# Altium schematic sheet Connectors.SchDoc
size Letter; Organization: MIT; SheetNumber: 2; SheetTotal: 5; Section: Connectors
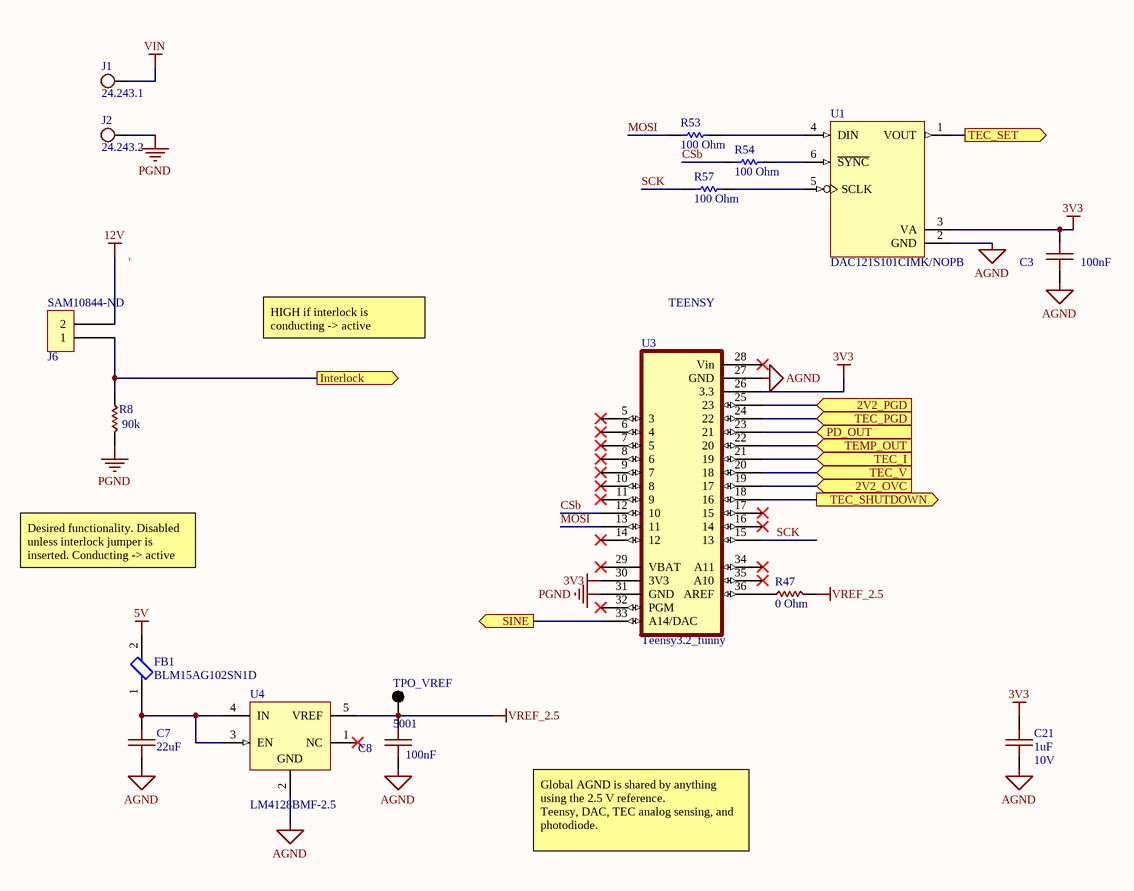
[diagram p0: Connectors.SchDoc]

## Parts
C3  100nF  [0603 B]
C7  22uF  [1210]
C8  100nF  [0603 B]
C21  1uF  Voltage: 10V  [0603 B]
FB1  BLM15AG102SN1D  [FP-BLM15-MFG]
J1  24.243.1  [BANANA RD]  (no BOM)
J2  24.243.2  [BANANA BK]  (no BOM)
J6  Supplier Part Number 1: SAM10844-ND  [SIL02]  (hidden comment: SIL02)
R8  90k  [0603]
R47  0 Ohm  [0603]
R53  100 Ohm  [RESC1608X55X30LL15T15]
R54  100 Ohm  [RESC1608X55X30LL15T15]
R57  100 Ohm  [RESC1608X55X30LL15T15]
TPO_VREF  5001  [KSTN-5001]
U1  DAC121S101CIMK/NOPB  [MK06A_N]
U3  Teensy3.2_funny  [Teensy32_funny]
U4  LM4128BMF-2.5  [DBV0005A_N]

## Ports
2V2_OVC (in), 2V2_PGD (in), Interlock (out), PD_OUT (in), SINE (out), TEC_I (in), TEC_PGD (in), TEC_SET (out), TEC_SHUTDOWN (out), TEC_V (in), TEMP_OUT (in)

## Nets
3V3: C3.1 C21.2 U1.3(VA) U3.26(3.3) U3.30(3V3)
5V: FB1.2
12V: J6.2
AGND: C3.2 C7.2 C8.2 C21.1 U1.2(GND) U3.27(GND) U4.2(GND)
PGND: J2.1(TP) R8.1 U3.31(GND)
VIN: J1.1(TP)
VREF_2.5: C8.1 R47.1 TPO_VREF.1 U4.5(VREF)
2V2_OVC: U3.19(17) ; port 2V2_OVC
2V2_PGD: U3.25(23) ; port 2V2_PGD
CSb: R54.1 U3.12(10)
Interlock: J6.1 R8.2 ; port Interlock
MOSI: R53.1 U3.13(11)
PD_OUT: U3.23(21) ; port PD_OUT
SCK: R57.1 U3.15(13)
SINE: U3.33(A14/DAC) ; port SINE
TEC_I: U3.21(19) ; port TEC_I
TEC_PGD: U3.24(22) ; port TEC_PGD
TEC_SET: U1.1(VOUT) ; port TEC_SET
TEC_SHUTDOWN: U3.18(16) ; port TEC_SHUTDOWN
TEC_V: U3.20(18) ; port TEC_V
TEMP_OUT: U3.22(20) ; port TEMP_OUT
NetC7_1: C7.1 FB1.1 U4.3(EN) U4.4(IN)
NetR47_2: R47.2 U3.36(AREF)
NetR53_2: R53.2 U1.4(DIN)
NetR54_2: R54.2 U1.6(~{SYNC})
NetR57_2: R57.2 U1.5(SCLK)

Not connected (* = marked no-connect by the designer): U3 5(3)* 6(4)* 7(5)* 8(6)* 9(7)* 10(8)* 11(9)* 14(12)* 16(14)* 17(15)* 28(Vin)* 29(VBAT)* 32(PGM)* 34(A11)* 35(A10)*; U4 1(NC)*

## Notes on the sheet
- '
- HIGH if interlock is conducting -> active
- TEENSY
- Desired functionality. Disabled unless interlock jumper is inserted. Conducting -> active
- Global AGND is shared by anything using the 2.5 V reference.
  Teensy, DAC, TEC analog sensing, and photodiode.
- Title
- Size
- Date
- Letter
- Section
- Time
- Sheet
- of
- Revision
- Drawn
- 33-207 / 77 Mass. Ave.
- Cambridge, MA 02139
- File

## Library data of the parts
C3 C8 = CAP 0603: 603 Capacitor; Value: 100nF
C7 = CAP 1210: 1210 Capacitor; Value: 22uF
C21 = CAP 0603: 603 Capacitor; Ref: C1608X7R1E105M080AB; Rating: X7R; Value: 1uF
FB1 = CMP-0686-00181-4: FERRITE BEAD 1 KOHM 0402 1LN; Manufacturer: Murata; 3DS Part Number: 310-00007; Impedance At Frequency: 1kΩ @ 100MHz; Tolerance: 25%; Series Resistance: 650mΩ; Test Frequency: 100MHz; Rms Current: 300mA; Manufacturer Part Number: BLM15AG102SN1D; Octopart: https://octopart.com/blm15ag102sn1d-murata-368316; RoHS: TRUE; Ipc Land Pattern Name: CAPC10050X50; Temperature Range High: +125°C; ComponentLink2Description: Datasheet; Device Class L1: Passive Components; Package: BLM15; Temperature Range Low: -55°C; Core Material: Ferrite; ComponentLink2URL: https://www.murata.com/en-us/products/productdata/8796740059166/ENFA0018.pdf?1514431813000; Mouser Description: Ferrite Beads 1K OHM HIGH SPEED SI; Digikey Description: FERRITE BEAD 1 KOHM 0402 1LN; Temperature: -55°C to +125°C; Category: FBead; Device Class L3: Ferrite Beads and Chips; Device Class L2: EMI / RFI Components; Automotive: No; Height: 0.55mm; Lead Free: Yes
J1 = BANANA RED: Banana jack, PCB mount right angle; Ref: 24.243.1
J2 = BANANA BLACK: Banana jack, PCB mount right angle; Ref: 24.243.2
J6 = SIL02: Conn Unshrouded Header HDR 2 POS 2.54mm Solder ST Top Entry Thru-Hole Bag; Manufacturer: Samtec; Manufacturer Part Number: TSW-102-07-F-S; Ref: 4x1 2.54MM HEADER; Number of Contacts: 2; Gender: Male; Max Current Rating: 7.6A; Max Voltage Rating (AC): 550V; Supplier 1: Digi-Key; RoHS: Yes; Category: Headers and Wire Housings; Stock 1: 35041; Pricing 1: 1=0.30000, 10=0.25500, 100=0.19800, 500=0.16968, 1000=0.14140, 5000=0.12120, 10000=0.11312 (USD); Mount: Through Hole; Contact Plating: Gold; Contact Material: Bronze; Color: Black; Housing Color: Black; Housing Material: Polyester; Contact Shape: Square; Contact Finish - Mating: GOLD; Insulation Material: PBT; Insulation Color: Black; Min Operating Temperature: -55°C; Max Operating Temperature: 125°C; Number of Rows: 1; Termination: Solder; Packaging: Bag; Number of Positions: 2; Orientation: Straight; Connector Type: Header; Fastening Type: Pull; Series: TSW; Contact Type: Male Pin; Package Quantity: 1; Length: 5.08mm; Pitch: 2.54mm; Contact Mating Length: 0.23inch; Depth: 2.54mm; Radiation Hardening: No; RoHS Compliant: Yes; Reach SVHC Compliant: Yes; Flammability Rating: UL94 V-0; ComponentLink1URL: https://datasheet.ciiva.com/739/tsw-xxx-xx-xxx-x-xx-xxx-mkt-739881.pdf?src-supplier=Digi-Key; ComponentLink1Description: https://datasheet.ciiva.com/739/tsw-xxx-xx-xxx-x-xx-xxx-mkt-739881.pdf?src-supplier=Digi-Key; ComponentLink2URL: https://datasheet.ciiva.com/10281/htsw-th-10281262.pdf?src-supplier=Avnet; ComponentLink2Description: https://datasheet.ciiva.com/10281/htsw-th-10281262.pdf?src-supplier=Avnet
R8 R47 = RES 0603: 603 Resistor
  R8: Value: 90k
  R47: Value: 0 Ohm
R53 R54 R57 = CMP-2000-00179-1: Manufacturer: Panasonic; Part Number: ERJ-3EKF1000V
TPO_VREF = CMP-2000-05181-1: Test Point, Black, 1-Pin THD, RoHS, Bulk; Manufacturer: Keystone; Other Names: 5001K; Catalog Drawings: 5000Series; Alternate Color: 5004K-ND / -TESTPOINTPCMINI.040"DYELLOW / 5003K-ND / -TESTPOINTPCMINI.040"DORANGE / 5002K-ND / -TESTPOINTPCMINI.040"DWHITE / 5000K-ND / -TESTPOINTPCMINI.040"DRED; Kits: DKTGRS232C-KIT-ND / -TTLCONVERTER; Online Catalog: ColorCodedTestPoints; Datasheet URL: https://ciiva.com/datasheet-click-2917627?src=ciiva&sig=bd195616; Mounting Type: 0.040"(1.02mm)HoleDiameter; Family: TestPoints; RoHS Information: RoHSComplianceStatement; Datasheet Version: Rev. G, 12/2008; Color: Black; Category: TestandMeasurement; Standard Package: 100; Manufacturer URL: http://www.keyelco.com/; Material: Base,Nylon46,UL94V-0; Type: PCTestPoint,Miniature; Terminal: 0.010"x0.020"(0.25mmx0.51mm)PhosphorBronzeWire,SilverPlated; Series: THM; Packaging: Bulk
U1 = CMP-0061-00064-2: 12-Bit Micro Power, RRO Digital-to-Analog Converter, 6-pin Tiny SOT23, Pb-Free; Manufacturer: National Semiconductor; PackageTopMarking: X61C*XTT; CompType: D/A Converter; PowerWise: Y; PinCount: 6; ComponentLink1URL: http://www.national.com/ds/DA/DAC121S101.pdf; Code_JEDEC: MO-193-AA; Code_IPC: SOT26A-6; PackageReference: MK06A; ComponentLink2Description: DAC121S101 Web Page; PackageDescription: Molded TSOT, 2.97 x 1.65 x 0.87mm Body, 6 Lead, 0.95mm Pitch; ComponentLink3Description: MK06A Package Page; ComponentLink1Description: DAC121S101 Datasheet; RoHS: Y; ComponentLink3URL: http://www.national.com/packaging/folders/mk06a.html; PackageVersion: revE, Nov-2008; RevisionNote: Component URLs added; DatasheetVersion: Feb-2010; ComponentLink2URL: http://www.national.com/pf/DA/DAC121S101.html
U4 = CMP-0074-00275-3: Precision Micropower Series Voltage Reference, 5-pin SOT-23; Manufacturer: Texas Instruments; CompType: Voltage Reference IC; PowerWise: Y; PackageTopMarking: R5CB*XTT; PinCount: 5; ComponentLink1Description: Datasheet; PackageReference: DBV0005A; PackageDescription: Molded SOT-23, .115 x .063 x .040 in Body, 5 Lead, .0375 in Pitch; ComponentLink1URL: http://www.ti.com/general/docs/lit/getliterature.tsp?genericPartNumber=LM4128&fileType=pdf; RevisionNote: Component URLs added; DatasheetVersion: Nov-2006; RoHS: N; PackageVersion: revD, Aug-2008